# EAGLE design i2c-7segled-SOIC (EAGLE 7.3.0)
CNAME: aaa
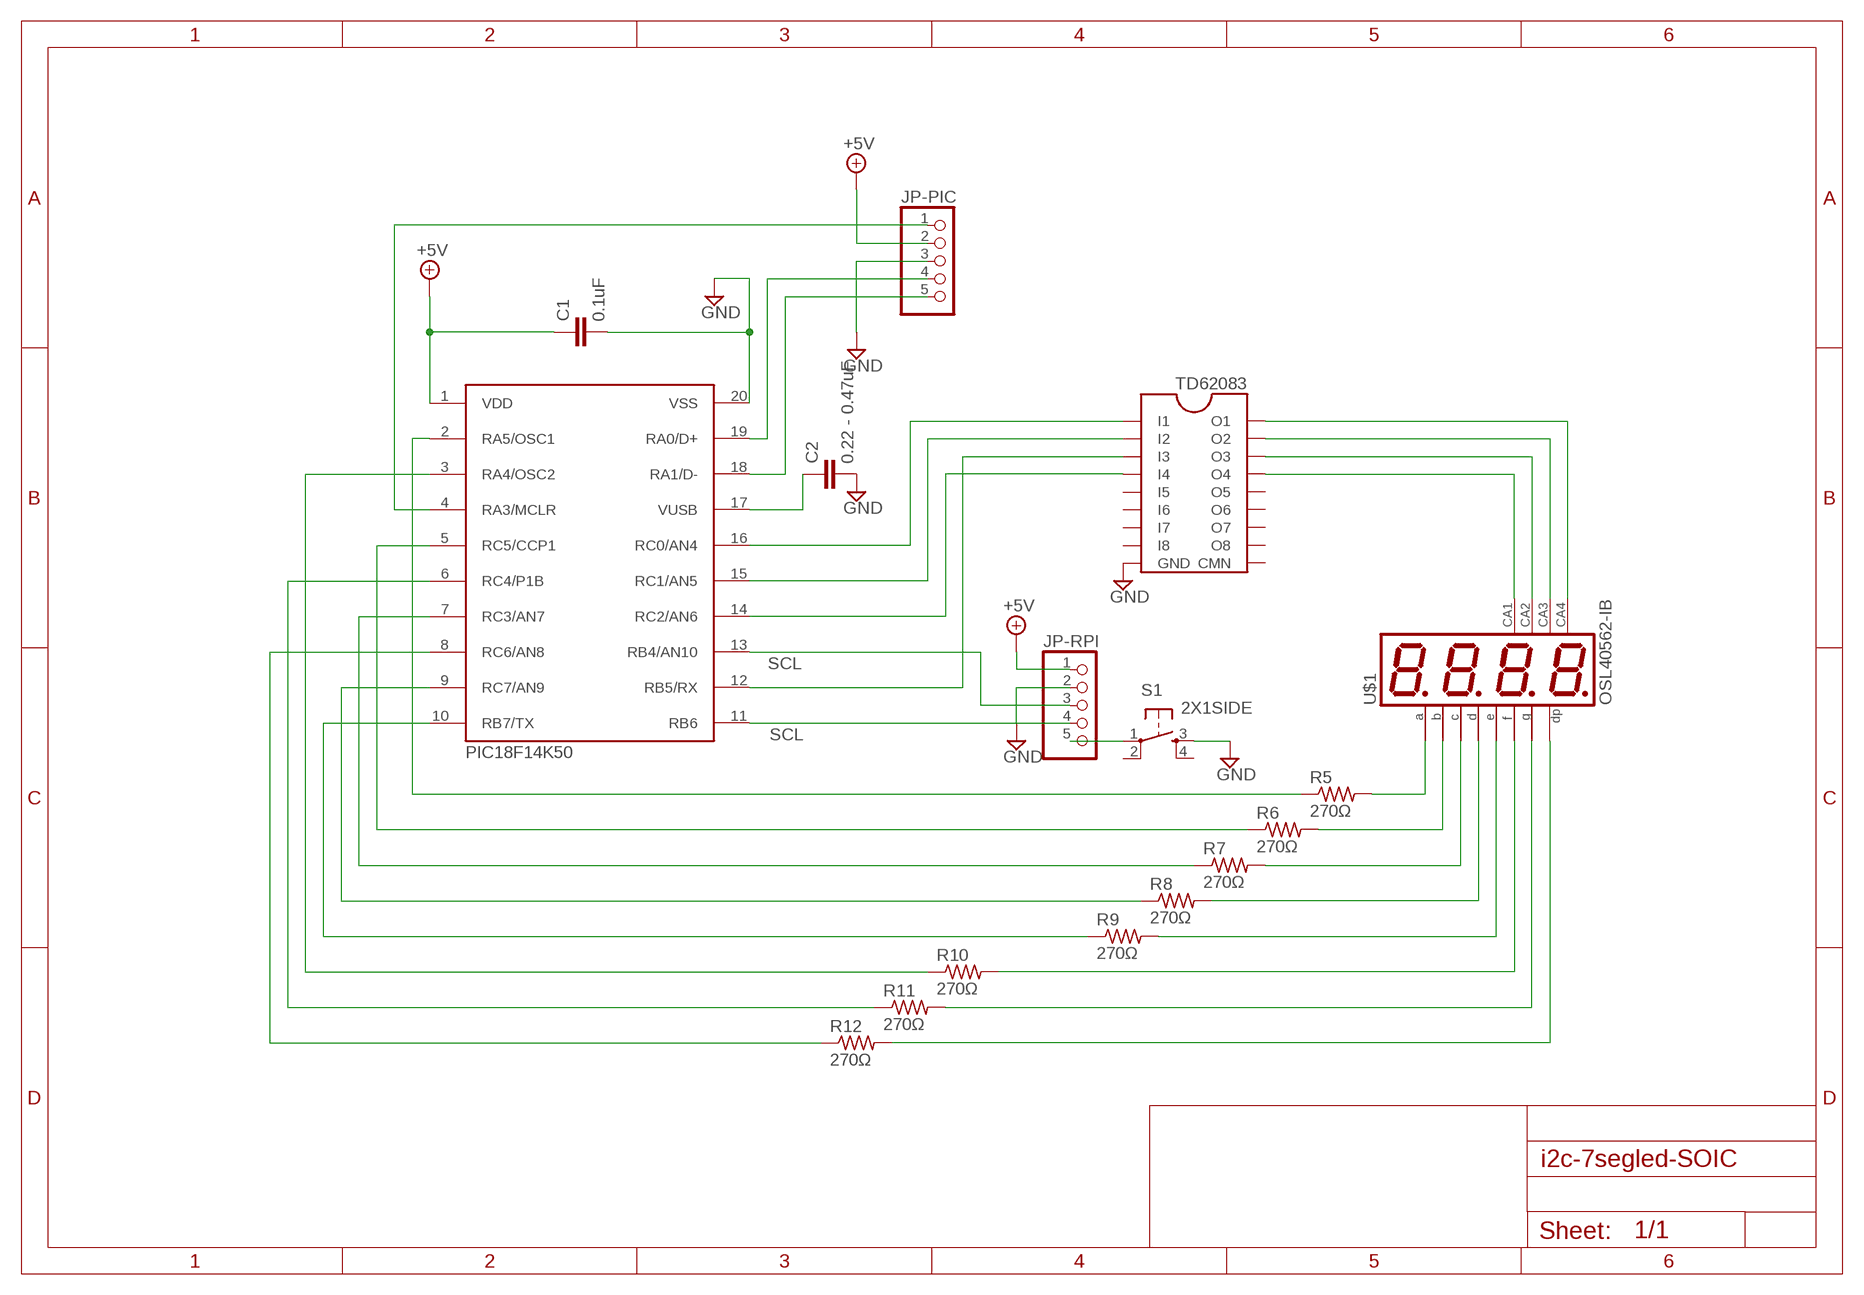
[diagram p0: schematic, sheet 1]

## Parts
C1  0.1uF  C-EUC0504  [C0504]
C2  0.22 - 0.47uF  C-EUC0504  [C0504]
JP-PIC  PINHD-1X5  [1X05]
JP-RPI  PINHD-1X5  [1X05]
PIC18F14K50  PIC18F14K50-SO  [SO20]
R5  270Ω  R-US_M0805  [M0805]
R6  270Ω  R-US_M0805  [M0805]
R7  270Ω  R-US_M0805  [M0805]
R8  270Ω  R-US_M0805  [M0805]
R9  270Ω  R-US_M0805  [M0805]
R10  270Ω  R-US_M0805  [M0805]
R11  270Ω  R-US_M0805  [M0805]
R12  270Ω  R-US_M0805  [M0805]
S1  2X1SIDE  [2X1SIDE]
U$1  OSL40562-IB  [OSL40562]
U$2  TD62083  [SO18]

## Nets
+5V: C1.1 JP-PIC.2 JP-RPI.1 PIC18F14K50.1(VDD)
GND: C1.2 C2.2 JP-PIC.3 JP-RPI.2 PIC18F14K50.20(VSS) S1.3(S) U$2.9(GND)
N$1: U$1.6(CA) U$2.18(O1)
N$3: C2.1 PIC18F14K50.17(VUSB)
N$4: PIC18F14K50.12(RB5/RX) U$2.3(I3)
N$5: JP-RPI.5 S1.1(P)
N$7: PIC18F14K50.14(RC2/AN6) U$2.4(I4)
N$8: PIC18F14K50.15(RC1/AN5) U$2.2(I2)
N$9: PIC18F14K50.16(RC0/AN4) U$2.1(I1)
N$11: U$1.9(CA) U$2.16(O3)
N$12: U$1.8(CA) U$2.17(O2)
N$13: U$1.12(CA) U$2.15(O4)
N$14: PIC18F14K50.2(RA5/OSC1) R5.1
N$15: R5.2 U$1.11(A)
N$16: PIC18F14K50.5(RC5/CCP1) R6.1
N$17: PIC18F14K50.7(RC3/AN7) R7.1
N$18: PIC18F14K50.9(RC7/AN9) R8.1
N$19: PIC18F14K50.10(RB7/TX) R9.1
N$20: PIC18F14K50.3(RA4/OSC2) R10.1
N$21: PIC18F14K50.6(RC4/P1B) R11.1
N$22: PIC18F14K50.8(RC6/AN8) R12.1
N$23: R6.2 U$1.7(B)
N$24: R7.2 U$1.4(C)
N$25: R8.2 U$1.2(D)
N$26: R9.2 U$1.1(E)
N$27: R10.2 U$1.10(F)
N$28: R11.2 U$1.5(G)
N$29: R12.2 U$1.3(DP)
N$30: JP-PIC.1 PIC18F14K50.4(RA3/MCLR)
N$31: JP-PIC.4 PIC18F14K50.19(RA0/D+)
N$32: JP-PIC.5 PIC18F14K50.18(RA1/D-)
N$49: JP-RPI.4 PIC18F14K50.11(RB6)
SCL: JP-RPI.3 PIC18F14K50.13(RB4/AN10)
Unconnected: S1.2(P1) S1.4(S1) U$2.5(I5) U$2.6(I6) U$2.7(I7) U$2.8(I8) U$2.10(CMN) U$2.11(O8) U$2.12(O7) U$2.13(O6) U$2.14(O5)

## Library data of the parts
C1 C2 = rcl:C-EU: CAPACITOR, European symbol
JP-PIC JP-RPI = pinhead:PINHD-1X5: PIN HEADER
PIC18F14K50 = pic18f14k50:PIC18F14K50-SO: 20-Lead Plastic Shrink Small Outline (SO) - Wide, 7.50mm Body [SOIC] Source: http://ww1.microchip.com/downloads/en/DeviceDoc/40001350F.pdf Souce: http://ww1.microchip.com/downloads/jp/DeviceDoc/41350D_JP.pdf (Japanese)
R5-R12 = rcl:R-US_: RESISTOR, American symbol
S1 = switch-custom:2X1SIDE: 横に倒したswitch pitch : 2x1 pin
U$1 = display-kingbright_2:OSL40562-?*: 14.22mm (0.56INCH) FOUR DIGIT NUMERIC DISPLAY OSL40562-xx(http://www.optosupply.com/UploadFile/PDF/osl40562-xx.pdf); COLOR: Blue; MCD: 50mcd; MN: 470nm; VF: 3.3V
U$2 = toshiba-td62083:TD62083: 8ch ダーリントン シンク ドライバ Source: http://akizukidenshi.com/download/TD62083AP.pdf

## Board
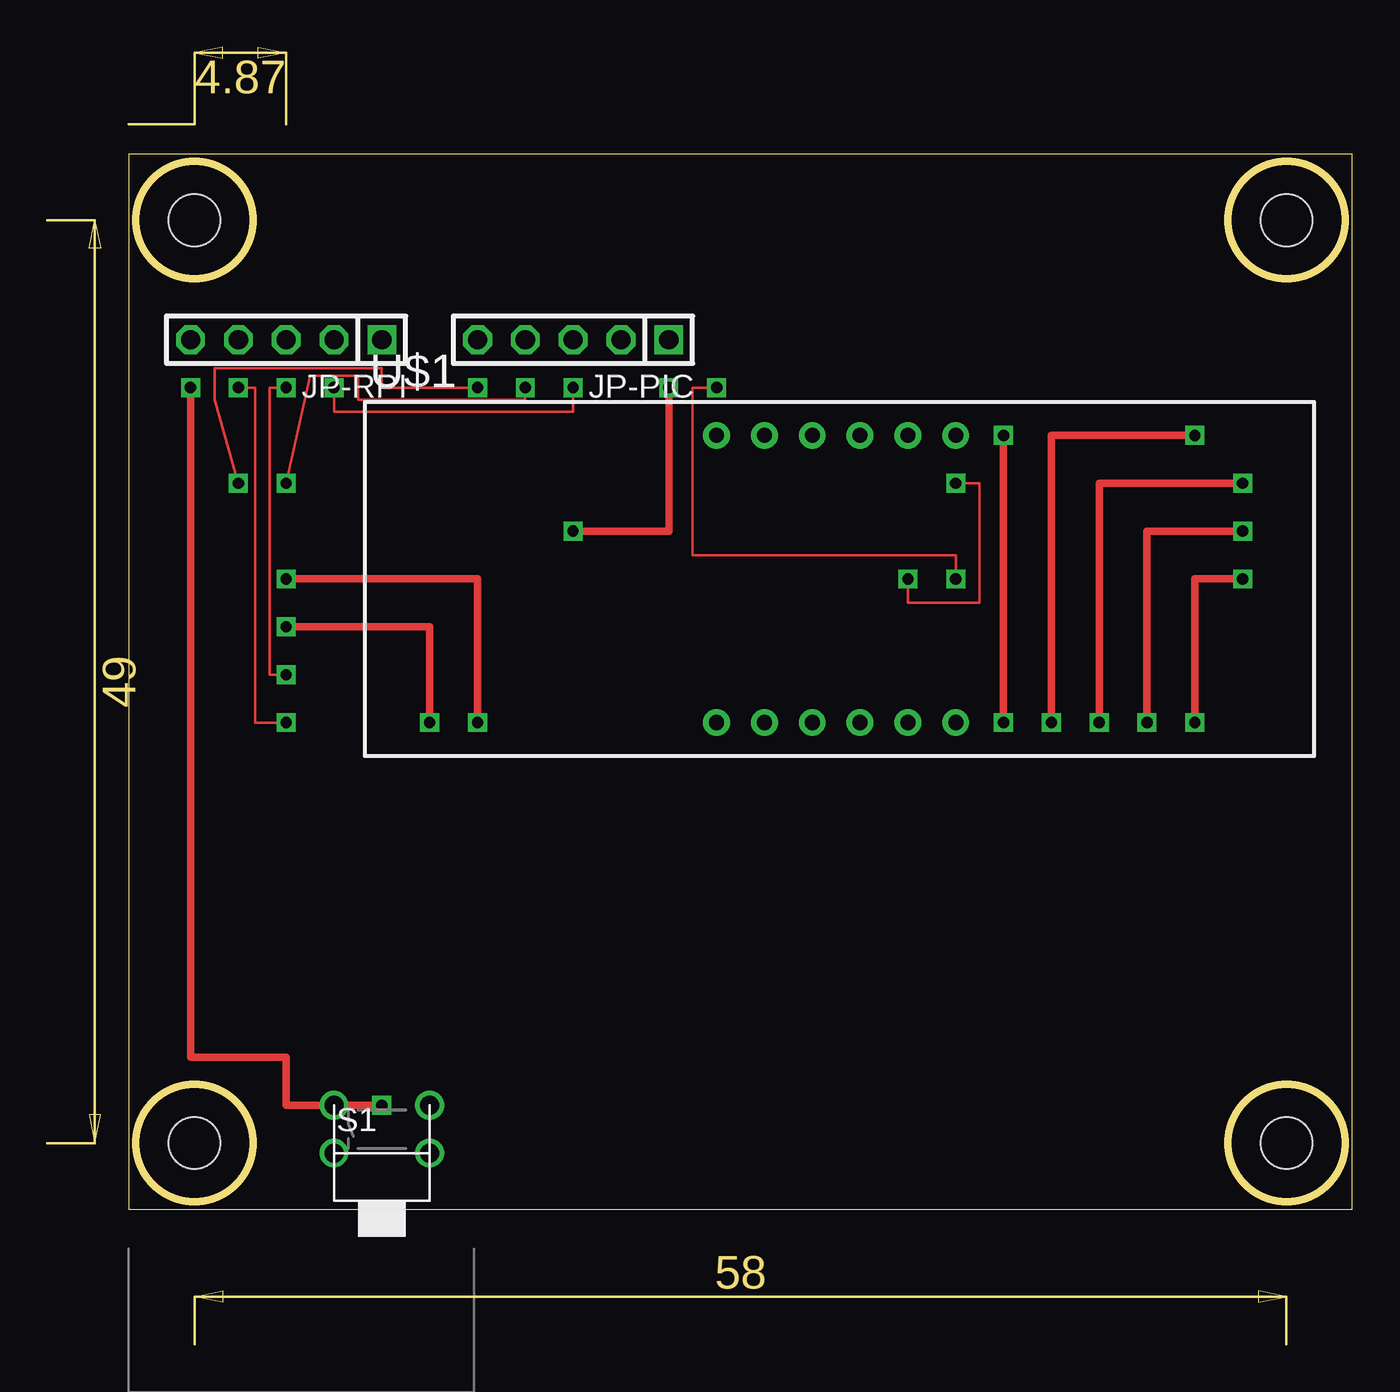
[diagram p1: board, top side]
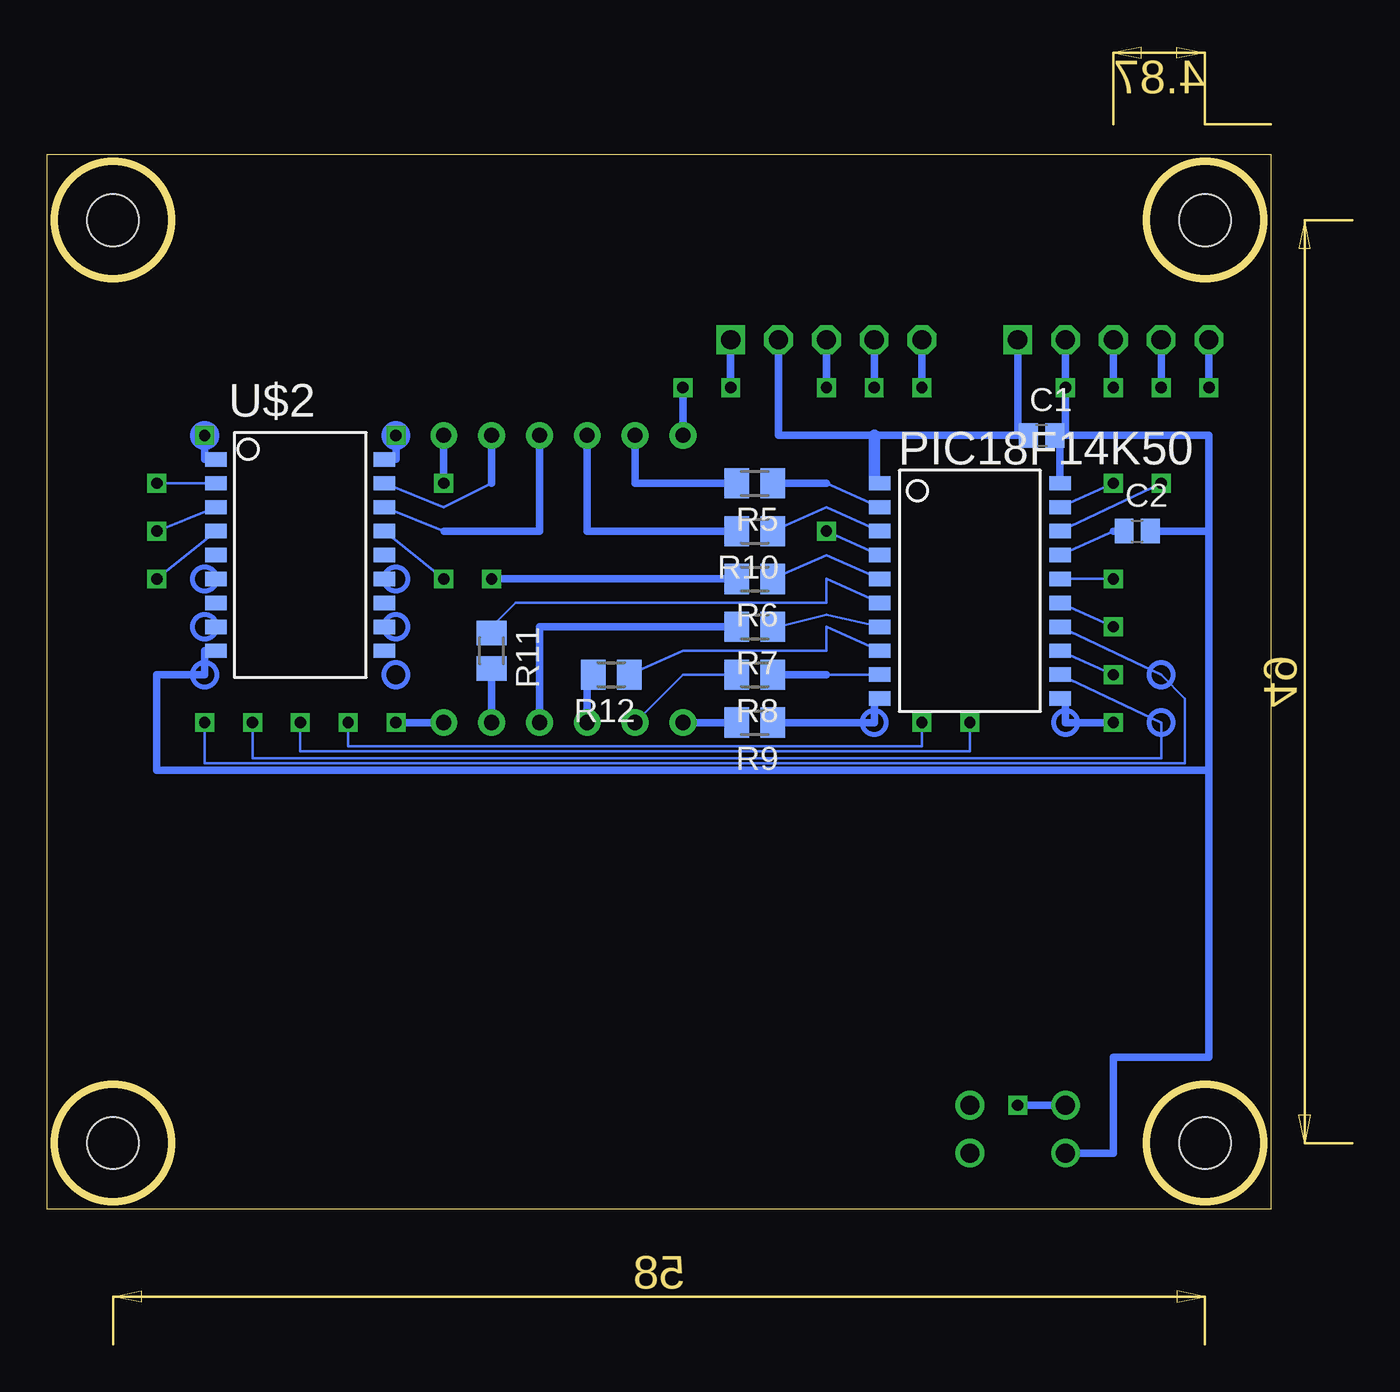
[diagram p2: board, bottom side, seen from below]

Size 65 x 56 mm. Coordinates in mm from the lower left corner, seen from the top.
Outline: 65,0 65,56 0,56 0,0 65,0
Outline: circle at 3.5,52.5 radius 3.1
Outline: circle at 3.5,3.5 radius 3.1
Outline: circle at 61.5,3.5 radius 3.1
Outline: circle at 61.5,52.5 radius 3.1
Copper layers (1*16): Top 0.035mm / dielectric 1.5mm / Bottom 0.035mm
Design rules "default *": minimum track width 5mil, minimum drill 14mil, track to track 8mil, track to pad 8mil, pad to pad 8mil, via to via 8mil, smd to smd 8mil, copper to edge 40mil, drill to drill 8mil, minimum pad ring 10mil, minimum via ring 8mil, stop-mask expansion 4mil, vias tented up to drill 0mil, thermal gap 10mil
Holes 2.75 mm at 3.5,52.5 3.5,3.5 61.5,3.5 61.5,52.5
bRestrict: area 14.7,48.7 to 57.9,56.3; area 7.1,48.7 to 9.6,56.3

### Footprints (pad centres in the part's own frame; a part is rotated, then mirrored left to right if it is on the bottom)
C0504 = smd 1 x 1.3: 1 -0.7,0; 2 0.7,0
1X05 = drill 1.016 square: 1 -5.08,0 | drill 1.016 octagon: 2 -2.54,0; 3 0,0; 4 2.54,0; 5 5.08,0
SO20 = smd 0.762 x 1.143: 1 -5.08,-4.788; 2 -3.81,-4.788; 3 -2.54,-4.788; 4 -1.27,-4.788; 5 0,-4.788; 6 1.27,-4.788; 7 2.54,-4.788; 8 3.81,-4.788; 9 5.08,-4.788; 10 6.35,-4.788; 11 6.35,4.788; 12 5.08,4.788; 13 3.81,4.788; 14 2.54,4.788; 15 1.27,4.788; 16 0,4.788; 17 -1.27,4.788; 18 -2.54,4.788; 19 -3.81,4.788; 20 -5.08,4.788
M0805 = smd 1.3 x 1.6: 1 -0.95,0; 2 0.95,0
2X1SIDE = drill 1.016: 1 -2.54,2.54; 2 2.54,2.54; 3 -2.54,0; 4 2.54,0
OSL40562 = drill 0.8 pad 1.422: 1 -6.35,-7.62; 2 -3.81,-7.62; 3 -1.27,-7.62; 4 1.27,-7.62; 5 3.81,-7.62; 6 6.35,-7.62; 7 6.35,7.62; 8 3.81,7.62; 9 1.27,7.62; 10 -1.27,7.62; 11 -3.81,7.62; 12 -6.35,7.62
SO18 = smd 0.762 x 1.143: 1 -5.08,-3.835; 2 -3.81,-3.835; 3 -2.54,-3.835; 4 -1.27,-3.835; 5 0,-3.835; 6 1.27,-3.835; 7 2.54,-3.835; 8 3.81,-3.835; 9 5.08,-3.835; 10 5.08,5.105; 11 3.81,5.105; 12 2.54,5.105; 13 1.27,5.105; 14 0,5.105; 15 -1.27,5.105; 16 -2.54,5.105; 17 -3.81,5.105; 18 -5.08,5.105

### Placement (x,y rotation side)
C1  12.18,41.07 0 bottom
C2  7.1,35.99 0 bottom
JP-PIC  23.61,46.15 180 top
JP-RPI  8.37,46.15 180 top
PIC18F14K50  15.99,33.45 270 bottom
R5  27.42,38.53 180 bottom
R6  27.42,33.45 180 bottom
R7  27.42,30.91 180 bottom
R8  27.42,28.37 180 bottom
R9  27.42,25.83 180 bottom
R10  27.42,35.99 180 bottom
R11  41.39,29.64 270 bottom
R12  35.04,28.37 180 bottom
S1  13.45,2.97 0 top
U$1  37.58,33.45 0 top
U$2  52.19,34.72 270 bottom
U$3  [A4L-LOC]  -90.69,-63.07 0 top  (outside the outline)

### Tracks (layer width: path | path; a pad name or v marks a point on that pad's centre or on a via)
+5V
  Bottom 0.406: C1.1 13.45,41.07 | 13.45,41.07 21.07,41.07 26.15,41.07 JP-PIC.2 | 21.07,38.53 PIC18F14K50.1 | JP-RPI.1 13.45,41.07
  Bottom 0.61: 21.07,41.07 21.07,38.53
GND  (via drill 0.6)
  Top 0.127: v10.91,43.61 10.91,42.34 23.61,42.34 v23.61,43.61
  Bottom 0.406: 10.91,41.07 C1.2 11.2,41.07 PIC18F14K50.20 | 10.91,41.07 v10.91,43.61 JP-RPI.2 | JP-PIC.3 v23.61,43.61 | 10.91,41.07 3.29,41.07 3.29,35.99 | C2.2 3.29,35.99 | 3.29,35.99 3.29,23.29 | 3.29,23.29 3.29,8.05 8.37,8.05 8.37,2.97 S1.3 | 3.29,23.29 59.17,23.29 59.17,28.37 56.63,28.37 56.63,29.64 U$2.9
N$1  (via drill 0.6)
  Top 0.406: v46.47,41.07 v46.47,25.83
  Bottom 0.127: U$2.18 47.1,39.8
  Bottom 0.406: 47.1,39.8 46.47,39.8 v46.47,41.07 | U$1.6 v46.47,25.83
N$3
  Bottom 0.127: 8.37,35.99 PIC18F14K50.17
  Bottom 0.406: C2.1 8.37,35.99
N$4  (via drill 0.6)
  Top 0.406: v54.09,25.83 54.09,35.99 v59.17,35.99
  Bottom 0.127: PIC18F14K50.12 5.83,25.83 5.83,23.93 54.09,23.93 v54.09,25.83 | U$2.3 v59.17,35.99
N$5  (via drill 0.6)
  Top 0.406: v3.29,43.61 3.29,8.05 8.37,8.05 8.37,5.51 v13.45,5.51
  Bottom 0.406: JP-RPI.5 v3.29,43.61 | v13.45,5.51 S1.1
N$7  (via drill 0.6)
  Top 0.406: v56.63,25.83 56.63,33.45 v59.17,33.45
  Bottom 0.127: PIC18F14K50.14 5.83,28.37 4.56,27.1 4.56,23.67 56.63,23.67 v56.63,25.83 | U$2.4 v59.17,33.45
N$8  (via drill 0.6)
  Top 0.406: v8.37,30.91 15.99,30.91 v15.99,25.83 | v51.55,25.83 51.55,38.53 v59.17,38.53
  Bottom 0.127: PIC18F14K50.15 v8.37,30.91 | v15.99,25.83 15.99,24.31 51.55,24.31 v51.55,25.83 | U$2.2 v59.17,38.53
N$9  (via drill 0.6)
  Top 0.406: v8.37,33.45 18.53,33.45 v18.53,25.83 | v49.01,25.83 49.01,41.07 v56.63,41.07
  Bottom 0.127: v8.37,33.45 PIC18F14K50.16 | v18.53,25.83 18.53,24.56 49.01,24.56 v49.01,25.83
  Bottom 0.406: U$2.1 56.63,39.8 v56.63,41.07
N$11
  Bottom 0.127: 43.91,35.99 U$2.16
  Bottom 0.406: U$1.9 38.85,35.99 43.91,35.99
N$12
  Bottom 0.127: 41.39,38.53 43.93,37.26 U$2.17
  Bottom 0.406: U$1.8 41.39,38.53
N$13  (via drill 0.6)
  Top 0.127: v43.93,33.45 43.93,34.72 29.96,34.72 29.96,43.61 v31.23,43.61
  Bottom 0.127: U$2.15 v43.93,33.45
  Bottom 0.406: U$1.12 v31.23,43.61
N$14
  Bottom 0.127: PIC18F14K50.2 23.61,38.53
  Bottom 0.406: 23.61,38.53 R5.1
N$15
  Bottom 0.406: U$1.11 33.77,38.53 R5.2
N$16
  Bottom 0.127: PIC18F14K50.5 23.61,34.72 R6.1
N$17
  Bottom 0.127: PIC18F14K50.7 23.61,31.54 26.15,30.91
  Bottom 0.406: 26.15,30.91 R7.1
N$18
  Bottom 0.127: PIC18F14K50.9 23.61,28.37
  Bottom 0.406: 23.61,28.37 R8.1
N$19
  Bottom 0.406: R9.1 21.07,25.83 21.07,27.1 PIC18F14K50.10
N$20
  Bottom 0.127: PIC18F14K50.3 23.61,37.26 R10.1
N$21
  Bottom 0.127: PIC18F14K50.6 23.61,33.45 23.61,32.18 40.12,32.18 41.39,30.91
  Bottom 0.406: 41.39,30.91 R11.1
N$22
  Bottom 0.127: PIC18F14K50.8 23.61,30.91 23.61,29.64 31.23,29.64 R12.1
N$23  (via drill 0.6)
  Top 0.127: v43.93,38.53 45.2,38.53 45.2,32.18 41.39,32.18 v41.39,33.45
  Bottom 0.406: R6.2 v41.39,33.45 | U$1.7 v43.93,38.53
N$24
  Bottom 0.406: R7.2 38.85,30.91 U$1.4
N$25
  Bottom 0.127: R8.2 31.23,28.37 U$1.2
N$26
  Bottom 0.406: R9.2 U$1.1
N$27
  Bottom 0.406: R10.2 36.31,35.99 U$1.10
N$28
  Bottom 0.406: R11.2 U$1.5
N$29
  Bottom 0.406: R12.2 36.31,28.37 U$1.3
N$30  (via drill 0.6)
  Top 0.406: v23.61,35.99 28.69,35.99 v28.69,43.61
  Bottom 0.127: PIC18F14K50.4 v23.61,35.99
  Bottom 0.406: JP-PIC.1 v28.69,43.61
N$31  (via drill 0.6)
  Top 0.127: v8.37,38.53 9.64,44.24 12.18,44.24 12.18,42.98 21.07,42.98 v21.07,43.61
  Bottom 0.127: PIC18F14K50.19 v8.37,38.53
  Bottom 0.406: v21.07,43.61 JP-PIC.4
N$32  (via drill 0.6)
  Top 0.127: v5.83,38.53 4.56,42.98 4.56,44.63 13.45,44.63 13.45,43.61 v18.53,43.61
  Bottom 0.127: PIC18F14K50.18 v5.83,38.53
  Bottom 0.406: v18.53,43.61 JP-PIC.5
N$49  (via drill 0.6)
  Top 0.127: v8.37,25.83 6.72,25.83 6.72,43.61 v5.83,43.61
  Bottom 0.406: PIC18F14K50.11 10.91,27.1 10.91,25.83 v8.37,25.83 | JP-RPI.4 v5.83,43.61
SCL  (via drill 0.6)
  Top 0.127: v8.37,43.61 7.48,43.61 7.48,28.37 v8.37,28.37
  Bottom 0.127: PIC18F14K50.13 v8.37,28.37
  Bottom 0.406: JP-RPI.3 v8.37,43.61
(copper drawn outside any net)
  shapes: Bottom circle x12

### Text on the board
Document: GPIO4 | SCL | SDA | GND | +5V
bDocu: 1